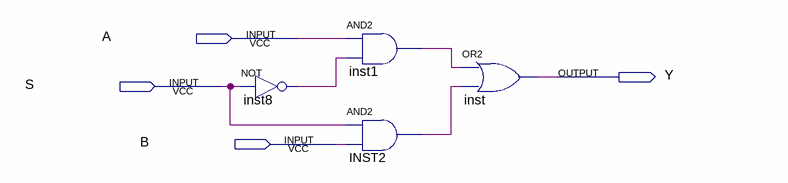
[diagram p0: schematic sheet]
// Quartus schematic multiplexer.bdf as structural Verilog: 4 symbols, 4 pins
module multiplexer (
  input  A,
  input  S,
  input  B,
  output Y
);

  wire inst1_out, INST2_out, inst8_out;

  not inst8 (inst8_out, S);
  and inst1 (inst1_out, A, inst8_out);
  and INST2 (INST2_out, S, B);
  or inst (Y, inst1_out, INST2_out);
endmodule
